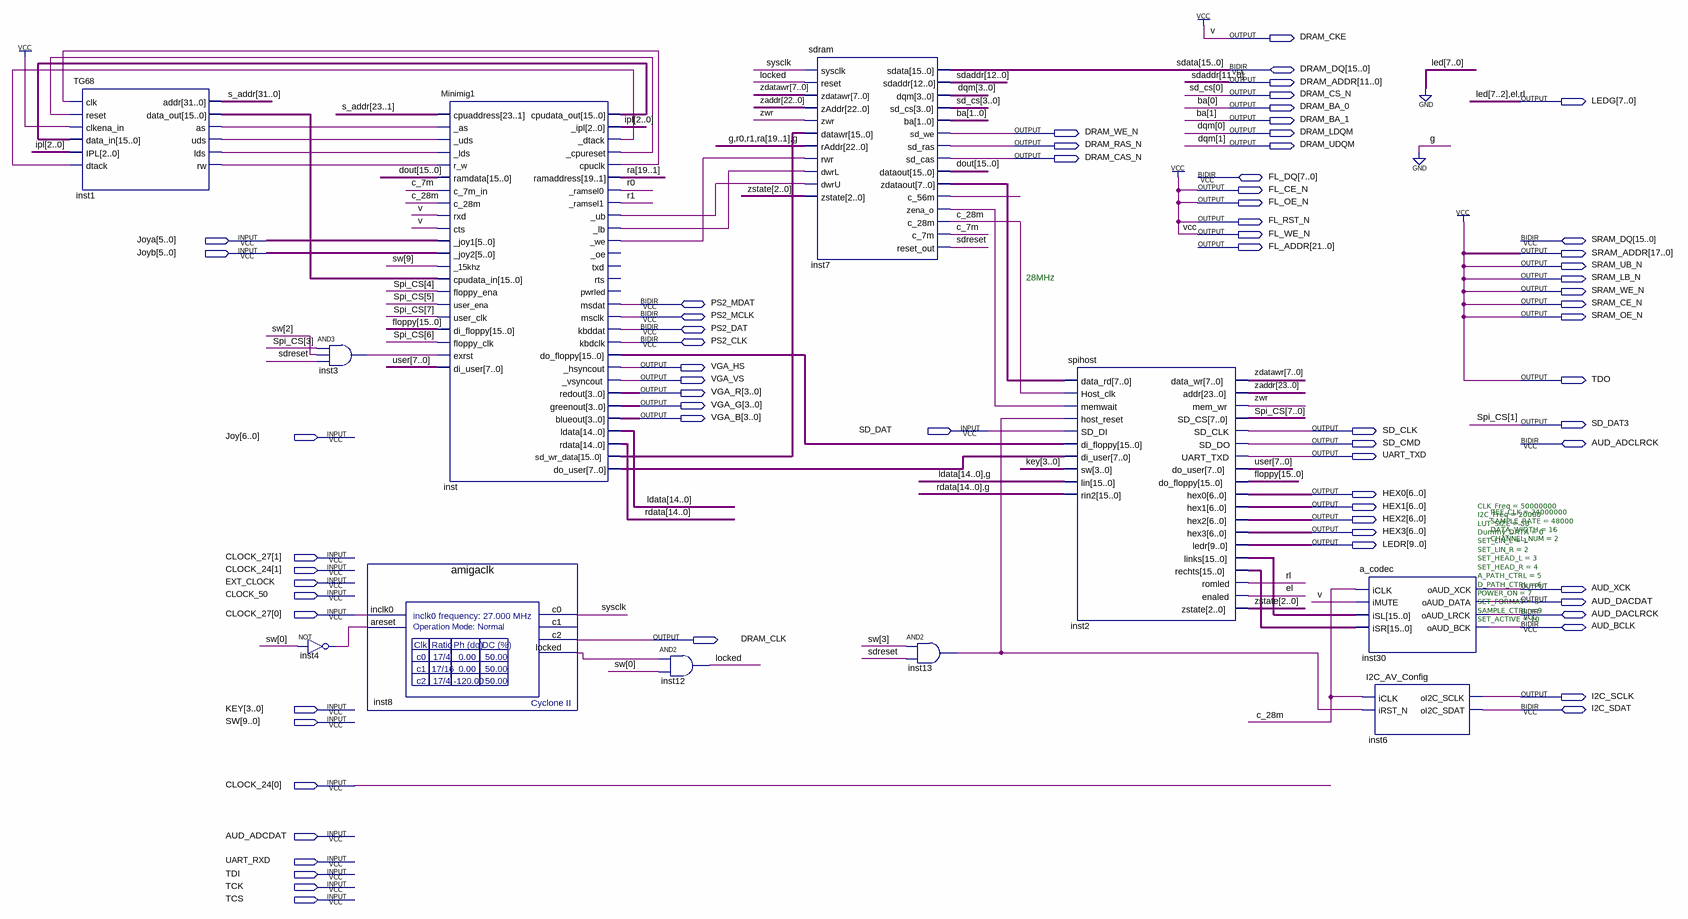
[diagram p0: schematic sheet]
// Quartus schematic minimig_de1.bdf as structural Verilog: 11 symbols, 69 pins
module minimig_de1 (
  input  [5:0] Joya,
  input  [5:0] Joyb,
  input  SD_DAT,
  input  [6:0] Joy,
  input  [1:0] CLOCK_27,
  input  [1:0] CLOCK_24,
  input  EXT_CLOCK,
  input  CLOCK_50,
  input  [3:0] KEY,
  input  [9:0] SW,
  input  AUD_ADCDAT,
  input  UART_RXD,
  input  TDI,
  input  TCK,
  input  TCS,
  inout  [15:0] DRAM_DQ,
  inout  [7:0] FL_DQ,
  inout  [15:0] SRAM_DQ,
  inout  PS2_MDAT,
  inout  PS2_MCLK,
  inout  PS2_DAT,
  inout  PS2_CLK,
  inout  AUD_ADCLRCK,
  inout  AUD_DACLRCK,
  inout  AUD_BCLK,
  inout  I2C_SDAT,
  output DRAM_CKE,
  output [11:0] DRAM_ADDR,
  output DRAM_CS_N,
  output [7:0] LEDG,
  output DRAM_BA_0,
  output DRAM_BA_1,
  output DRAM_WE_N,
  output DRAM_LDQM,
  output DRAM_RAS_N,
  output DRAM_UDQM,
  output DRAM_CAS_N,
  output FL_CE_N,
  output FL_OE_N,
  output FL_RST_N,
  output FL_WE_N,
  output [21:0] FL_ADDR,
  output [17:0] SRAM_ADDR,
  output SRAM_UB_N,
  output SRAM_LB_N,
  output SRAM_WE_N,
  output SRAM_CE_N,
  output SRAM_OE_N,
  output VGA_HS,
  output VGA_VS,
  output TDO,
  output [3:0] VGA_R,
  output [3:0] VGA_G,
  output [3:0] VGA_B,
  output SD_DAT3,
  output SD_CLK,
  output SD_CMD,
  output UART_TXD,
  output [6:0] HEX0,
  output [6:0] HEX1,
  output [6:0] HEX2,
  output [6:0] HEX3,
  output [9:0] LEDR,
  output AUD_XCK,
  output AUD_DACDAT,
  output DRAM_CLK,
  output I2C_SCLK
);

  wire c_7m, c_28m, inst1_as, inst1_lds, inst1_rw, inst1_uds, inst3_out, inst4_out, inst7_c_56m,
       inst7_zena_o, inst8_locked, inst13_out, inst__cpureset, inst__dtack, inst__lb, inst__ub, inst__we,
       inst_cpuclk, locked, r0, r1, sdreset, sysclk, zwr;
  wire [2:0] ipl, zstate;
  wire [3:1] sd_cs;
  wire [3:2] dqm;
  wire [7:0] inst7_zdataout, inst_do_user, Spi_CS, user, zdatawr;
  wire [12:12] sdaddr;
  wire [14:0] ldata, rdata;
  wire [15:0] dout, floppy, inst1_data_out, inst2_links, inst2_rechts, inst_cpudata_out, inst_do_floppy,
       inst_sd_wr_data;
  wire [19:1] ra;
  wire [23:0] zaddr;
  wire [31:0] s_addr;

  TG68 inst1 (
    .clk(inst_cpuclk), .reset(inst__cpureset), .clkena_in(1'b1), .data_in(inst_cpudata_out), .IPL(ipl),
    .dtack(inst__dtack), .addr(s_addr), .data_out(inst1_data_out), .as(inst1_as), .uds(inst1_uds),
    .lds(inst1_lds), .rw(inst1_rw));
  and inst3 (inst3_out, Spi_CS[3], SW[2], sdreset);
  not inst4 (inst4_out, SW[0]);
  amigaclk inst8 (
    .inclk0(CLOCK_27[0]), .areset(inst4_out), .c0(sysclk), .c2(DRAM_CLK), .locked(inst8_locked));  // open: c1
  Minimig1 inst (
    .cpuaddress(s_addr[23:1]), ._as(inst1_as), ._uds(inst1_uds), ._lds(inst1_lds), .r_w(inst1_rw),
    .ramdata(dout), .c_7m_in(c_7m), .c_28m(c_28m), .rxd(1'b1), .cts(1'b1), ._joy1(Joya), ._joy2(Joyb),
    ._15khz(SW[9]), .cpudata_in(inst1_data_out), .floppy_ena(Spi_CS[4]), .user_ena(Spi_CS[5]),
    .user_clk(Spi_CS[7]), .di_floppy(floppy), .floppy_clk(Spi_CS[6]), .exrst(inst3_out), .di_user(user),
    .cpudata_out(inst_cpudata_out), ._ipl(ipl), ._dtack(inst__dtack), ._cpureset(inst__cpureset),
    .cpuclk(inst_cpuclk), .ramaddress(ra), ._ramsel0(r0), ._ramsel1(r1), ._ub(inst__ub), ._lb(inst__lb),
    ._we(inst__we), .do_floppy(inst_do_floppy), ._hsyncout(VGA_HS), ._vsyncout(VGA_VS), .redout(VGA_R),
    .greenout(VGA_G), .blueout(VGA_B), .ldata(ldata), .rdata(rdata), .sd_wr_data(inst_sd_wr_data),
    .do_user(inst_do_user), .msdat(PS2_MDAT), .msclk(PS2_MCLK), .kbddat(PS2_DAT), .kbdclk(PS2_CLK));  // open: _oe, txd, rts, pwrled
  and inst12 (locked, inst8_locked, SW[0]);
  sdram inst7 (
    .sysclk(sysclk), .reset(locked), .zdatawr(zdatawr), .zAddr(zaddr[22:0]), .zwr(zwr),
    .datawr(inst_sd_wr_data), .rAddr({1'b0, r0, r1, ra, 1'b0}), .rwr(inst__we), .dwrL(inst__lb),
    .dwrU(inst__ub), .zstate(zstate), .sdaddr({sdaddr[12], DRAM_ADDR}), .dqm({dqm, DRAM_UDQM, DRAM_LDQM}),
    .sd_cs({sd_cs, DRAM_CS_N}), .ba({DRAM_BA_1, DRAM_BA_0}), .sd_we(DRAM_WE_N), .sd_ras(DRAM_RAS_N),
    .sd_cas(DRAM_CAS_N), .dataout(dout), .zdataout(inst7_zdataout), .c_56m(inst7_c_56m),
    .zena_o(inst7_zena_o), .c_28m(c_28m), .c_7m(c_7m), .reset_out(sdreset), .sdata(DRAM_DQ));
  and inst13 (inst13_out, SW[3], sdreset);
  spihost inst2 (
    .data_rd(inst7_zdataout), .Host_clk(c_28m), .memwait(inst7_zena_o), .host_reset(inst13_out),
    .SD_DI(SD_DAT), .di_floppy(inst_do_floppy), .di_user(inst_do_user), .sw(KEY), .lin({ldata, 1'b0}),
    .rin2({rdata, 1'b0}), .data_wr(zdatawr), .addr(zaddr), .mem_wr(zwr),
    .SD_CS({Spi_CS[7:2], SD_DAT3, Spi_CS[0]}), .SD_CLK(SD_CLK), .SD_DO(SD_CMD), .UART_TXD(UART_TXD),
    .do_user(user), .do_floppy(floppy), .hex0(HEX0), .hex1(HEX1), .hex2(HEX2), .hex3(HEX3), .ledr(LEDR),
    .links(inst2_links), .rechts(inst2_rechts), .romled(LEDG[0]), .enaled(LEDG[1]), .zstate(zstate));
  a_codec #(.REF_CLK(24000000), .SAMPLE_RATE(48000), .DATA_WIDTH(16), .CHANNEL_NUM(2)) inst30 (
    .iCLK(c_28m), .iMUTE(1'b1), .iSL(inst2_links), .iSR(inst2_rechts), .oAUD_XCK(AUD_XCK),
    .oAUD_DATA(AUD_DACDAT), .oAUD_LRCK(AUD_DACLRCK), .oAUD_BCK(AUD_BCLK));
  I2C_AV_Config #(.CLK_Freq(50000000), .I2C_Freq(20000), .LUT_SIZE(50), .Dummy_DATA(0), .SET_LIN_L(1), .SET_LIN_R(2), .SET_HEAD_L(3), .SET_HEAD_R(4), .A_PATH_CTRL(5), .D_PATH_CTRL(6), .POWER_ON(7), .SET_FORMAT(8), .SAMPLE_CTRL(9), .SET_ACTIVE(10)) inst6 (
    .iCLK(c_28m), .iRST_N(inst13_out), .oI2C_SCLK(I2C_SCLK), .oI2C_SDAT(I2C_SDAT));

  assign DRAM_CKE = 1'b1;
  assign FL_CE_N = 1'b1;
  assign FL_OE_N = 1'b1;
  assign FL_RST_N = 1'b1;
  assign FL_WE_N = 1'b1;
  assign LEDG[7:2] = {6{1'b0}};
  assign SRAM_CE_N = 1'b1;
  assign SRAM_LB_N = 1'b1;
  assign SRAM_OE_N = 1'b1;
  assign SRAM_UB_N = 1'b1;
  assign SRAM_WE_N = 1'b1;
  assign TDO = 1'b1;

  // Other names for the same wires on the sheet: ba[1:0] = {DRAM_BA_1, DRAM_BA_0}; dqm[1:0] = {DRAM_UDQM, DRAM_LDQM};
  //   el = LEDG[1]; rl = LEDG[0]; sd_cs[0] = DRAM_CS_N; sdaddr[11:0] = DRAM_ADDR; sdata[15:0] = DRAM_DQ;
  //   Spi_CS[1] = SD_DAT3

  // Notes on the sheet:
  //   28MHz
endmodule
